# EAGLE schematic 2i (EAGLE 6.4)
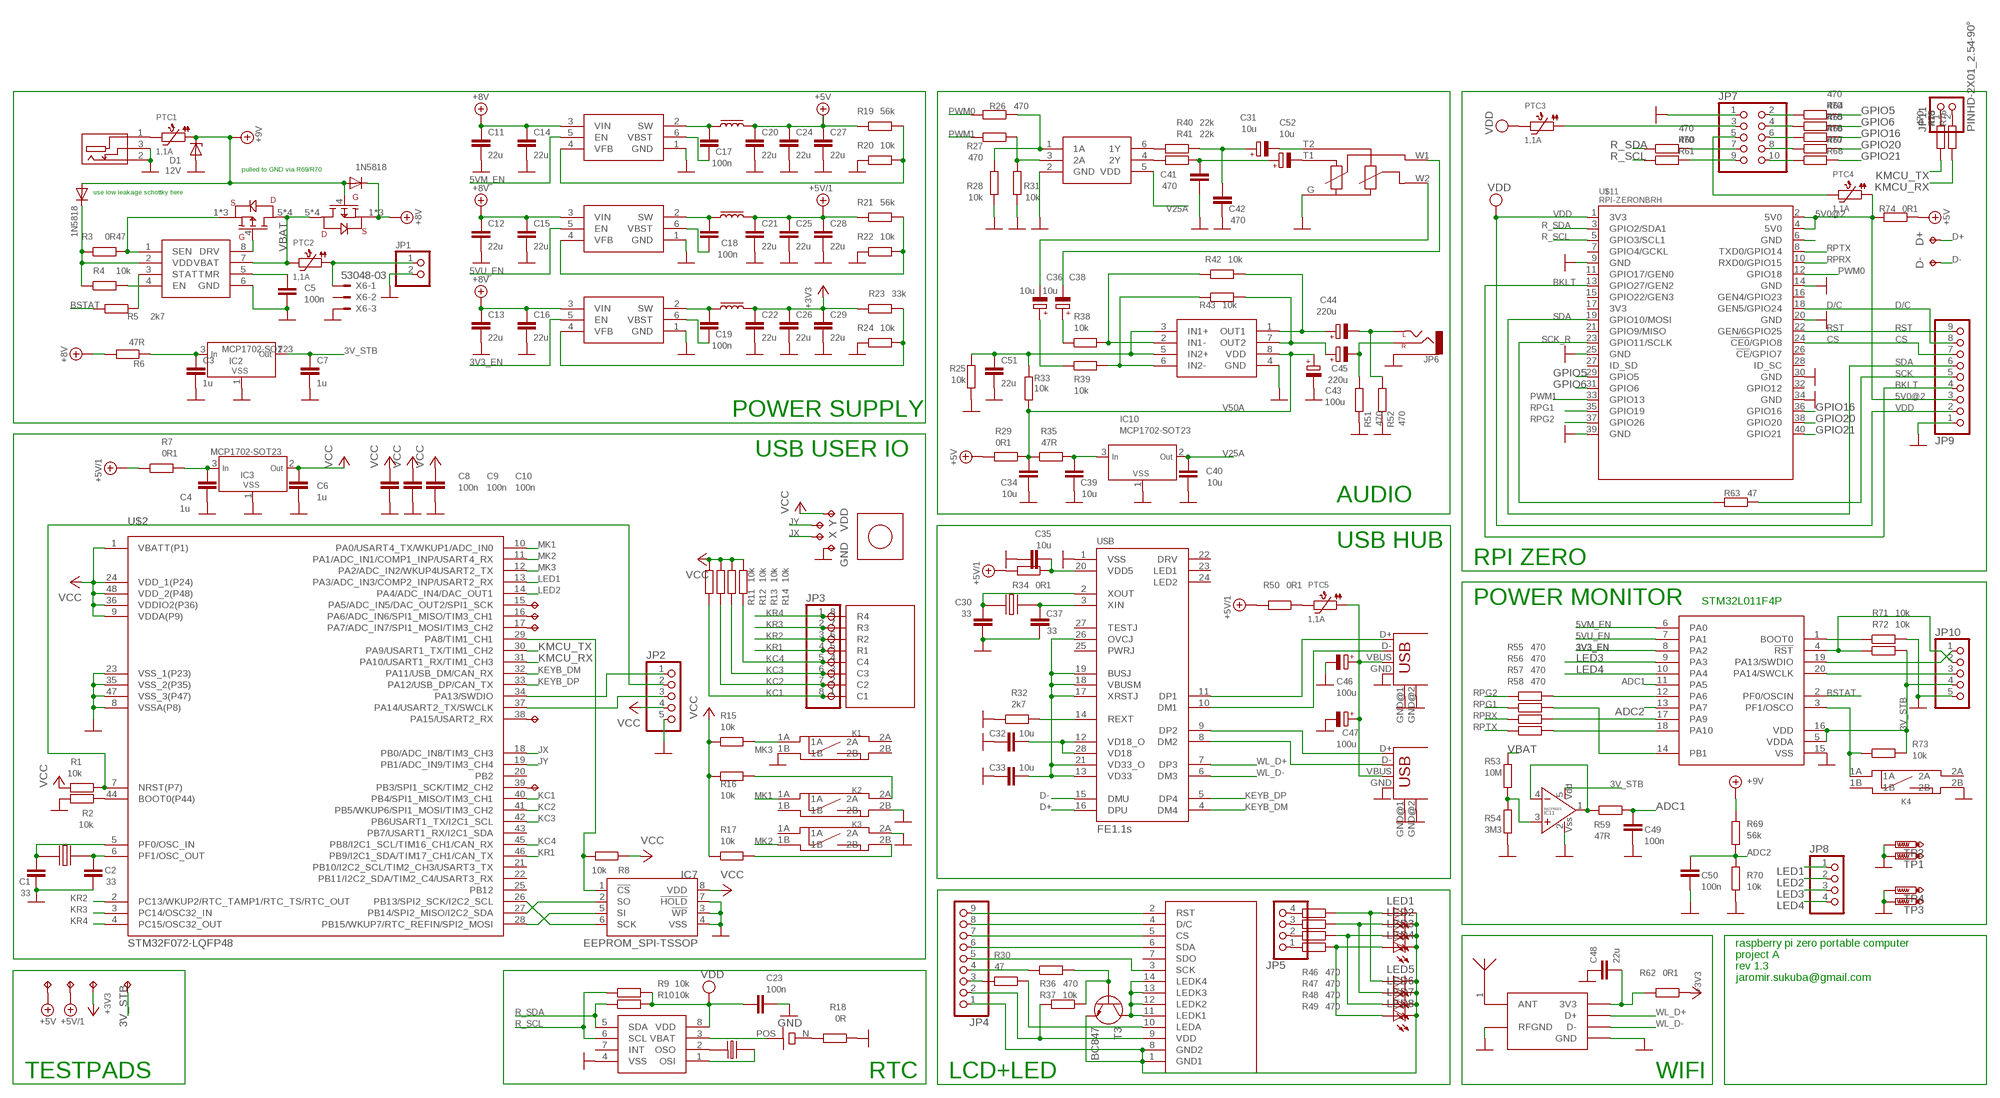
[diagram p0: schematic, sheet 1]

## Parts
ANT1  ANT_RAINSUN_24GHZ  [ANT_RAINSUN-24G]
C1  33  C_0806  [R0805]
C2  33  C_0806  [R0805]
C3  1u  C_0806  [R0805]
C4  1u  C_0806  [R0805]
C5  100n  C_0806  [R0805]
C6  1u  C_0806  [R0805]
C7  1u  C_0806  [R0805]
C8  100n  C_0806  [R0805]
C9  100n  C_0806  [R0805]
C10  100n  C_0806  [R0805]
C11  22u  C_0806  [R0805]
C12  22u  C_0806  [R0805]
C13  22u  C_0806  [R0805]
C14  22u  C_0806  [R0805]
C15  22u  C_0806  [R0805]
C16  22u  C_0806  [R0805]
C17  100n  C_0806  [R0805]
C18  100n  C_0806  [R0805]
C19  100n  C_0806  [R0805]
C20  22u  C_0806  [R0805]
C21  22u  C_0806  [R0805]
C22  22u  C_0806  [R0805]
C23  100n  C_0806  [R0805]
C24  22u  C_0806  [R0805]
C25  22u  C_0806  [R0805]
C26  22u  C_0806  [R0805]
C27  22u  C_0806  [R0805]
C28  22u  C_0806  [R0805]
C29  22u  C_0806  [R0805]
C30  33  C_0806  [R0805]
C31  10u  CPOL-EUA  [PANASONIC_A]
C32  10u  C_0806  [R0805]
C33  10u  C_0806  [R0805]
C34  10u  C_0806  [R0805]
C35  10u  C_0806  [R0805]
C36  10u  CPOL-EUA  [PANASONIC_A]
C37  33  C_0806  [R0805]
C38  10u  CPOL-EUA  [PANASONIC_A]
C39  10u  C_0806  [R0805]
C40  10u  C_0806  [R0805]
C41  470  C_0806  [R0805]
C42  470  C_0806  [R0805]
C43  100u  CPOL-EUD  [PANASONIC_D]
C44  220u  CPOL-EUD  [PANASONIC_D]
C45  220u  CPOL-EUD  [PANASONIC_D]
C46  100u  CPOL-EUD  [PANASONIC_D]
C47  100u  CPOL-EUD  [PANASONIC_D]
C48  22u  C_0806  [R0805]
C49  100n  C_0806  [R0805]
C50  100n  C_0806  [R0805]
C51  22u  C_0806  [R0805]
C52  10u  CPOL-EUA  [PANASONIC_A]
D1  12V  ZENER-DIODESMB  [SMB]
D2  1N5818  DIODE-SMB  [SMB]
D3  1N5818  DIODE-SMB  [SMB]
D+  TPTP14R  [TP14R]
D-  TPTP14R  [TP14R]
GND  TPTP14R  [TP14R]
IC1  MCP73844  [MSOP8]
IC2  MCP1702-SOT23  [SOT23]
IC3  MCP1702-SOT23  [SOT23]
IC4  TPS562200  [SOT23-6]
IC5  TPS562200  [SOT23-6]
IC6  TPS562200  [SOT23-6]
IC7  EEPROM_SPI-TSSOP  [TSSOP8W]
IC8  PCF8523  [SO-08]
IC9  74LVC2G34  [SOT23-6]
IC10  MCP1702-SOT23  [SOT23]
IC11  MCP6021  [SOT23-5L]
JP1  PINHD-1X02_2.54-90°  [1X02/90]
JP2  PINHD-1X05_2.54-90°  [1X05/90]
JP3  PINHD-1X08_2.54  [1X08]
JP4  PINHD-1X09_2.00  [1X09M]
JP5  PINHD-1X04_2.00  [1X04M]
JP6  AUDIO-JACKPTH  [AUDIO-JACK]
JP7  PINHD-2X05_2.54-90°  [2X05/90]
JP8  PINHD-1X04_2.00  [1X04M]
JP9  PINHD-1X09_2.00  [1X09M]
JP10  PINHD-1X05_2.54-90°  [1X05/90]
JP11  PINHD-2X01_2.54-90°  [2X01/90]
K1  SWITCH_BD_B  [SW_SMD2]
K2  SWITCH_BD_B  [SW_SMD2]
K3  SWITCH_BD_B  [SW_SMD2]
K4  SWITCH_BD_B  [SW_SMD2]
LED1  LED3MM  [LED3MM]
LED2  LED3MM  [LED3MM]
LED3  LED3MM  [LED3MM]
LED4  LED3MM  [LED3MM]
LED5  LEDCHIPLED_0805  [CHIPLED_0805]
LED6  LEDCHIPLED_0805  [CHIPLED_0805]
LED7  LEDCHIPLED_0805  [CHIPLED_0805]
LED8  LEDCHIPLED_0805  [CHIPLED_0805]
MOD1  MOD_USB_RTL8188  [MOD_USB_RTL8188]
PTC1  1,1A  PTC1812  [PTC1812]
PTC2  1,1A  PTC1812  [PTC1812]
PTC3  1,1A  PTC1812  [PTC1812]
PTC4  1,1A  PTC1812  [PTC1812]
PTC5  1,1A  PTC1812  [PTC1812]
Q1  CRYSTAL87X38  [CRYST_32K_87X38MM]
R1  10k  R_0805  [R0805]
R2  10k  R_0805  [R0805]
R3  0R47  R_1206  [R1206]
R4  10k  R_0805  [R0805]
R5  2k7  R_0805  [R0805]
R6  47R  R_0805  [R0805]
R7  0R1  R_1206  [R1206]
R8  10k  R_0805  [R0805]
R9  10k  R_0805  [R0805]
R10  10k  R_0805  [R0805]
R11  10k  R_0805  [R0805]
R12  10k  R_0805  [R0805]
R13  10k  R_0805  [R0805]
R14  10k  R_0805  [R0805]
R15  10k  R_0805  [R0805]
R16  10k  R_0805  [R0805]
R17  10k  R_0805  [R0805]
R18  0R  R_0805  [R0805]
R19  56k  R_0805  [R0805]
R20  10k  R_0805  [R0805]
R21  56k  R_0805  [R0805]
R22  10k  R_0805  [R0805]
R23  33k  R_0805  [R0805]
R24  10k  R_0805  [R0805]
R25  10k  R_0805  [R0805]
R26  470  R_0805  [R0805]
R27  470  R_0805  [R0805]
R28  10k  R_0805  [R0805]
R29  0R1  R_1206  [R1206]
R30  47  R_0805  [R0805]
R31  10k  R_0805  [R0805]
R32  2k7  R_0805  [R0805]
R33  10k  R_0805  [R0805]
R34  0R1  R_1206  [R1206]
R35  47R  R_0805  [R0805]
R36  470  R_0805  [R0805]
R37  10k  R_0805  [R0805]
R38  10k  R_0805  [R0805]
R39  10k  R_0805  [R0805]
R40  22k  R_0805  [R0805]
R41  22k  R_0805  [R0805]
R42  10k  R_0805  [R0805]
R43  10k  R_0805  [R0805]
R46  470  R_0805  [R0805]
R47  470  R_0805  [R0805]
R48  470  R_0805  [R0805]
R49  470  R_0805  [R0805]
R50  0R1  R_1206  [R1206]
R51  470  R_0805  [R0805]
R52  470  R_0805  [R0805]
R53  10M  R_0805  [R0805]
R54  3M3  R_0805  [R0805]
R55  470  R_0805  [R0805]
R56  470  R_0805  [R0805]
R57  470  R_0805  [R0805]
R58  470  R_0805  [R0805]
R59  47R  R_0805  [R0805]
R60  470  R_0805  [R0805]
R61  470  R_0805  [R0805]
R62  0R1  R_1206  [R1206]
R63  47  R_0805  [R0805]
R64  470  R_0805  [R0805]
R65  470  R_0805  [R0805]
R66  470  R_0805  [R0805]
R67  470  R_0805  [R0805]
R68  470  R_0805  [R0805]
R69  56k  R_0805  [R0805]
R70  10k  R_0805  [R0805]
R71  10k  R_0805  [R0805]
R72  10k  R_0805  [R0805]
R73  10k  R_0805  [R0805]
R74  0R1  R_1206  [R1206]
R75  470  R_0805  [R0805]
R76  470  R_0805  [R0805]
T1  PFET_SO8  [SO-08]
T2  PFET_SO8  [SO-08]
T3  BC847  [SOT23]
TFT1  DISP_ILI_28  [DISP_ILI_28]
TP1  PTR1PAD1-13  [P1-13]
TP2  PTR1PAD1-13  [P1-13]
TP3  PTR1PAD1-13  [P1-13]
TP4  PTR1PAD1-13  [P1-13]
U$1  CONN_DC_13  [CON_DC13]
U$2  STM32F072-LQFP48  [LQFP48]
U$3  2u2  INDUCTORBOURNS_SRP7030  [BOURNS_SRP7030]
U$4  2u2  INDUCTORBOURNS_SRP7030  [BOURNS_SRP7030]
U$5  2u2  INDUCTORBOURNS_SRP7030  [BOURNS_SRP7030]
U$6  BATTH1220  [BATT_HOLDER_DS1092-12]
U$7  KB1604  [KB1604]
U$8  JOY_PS  [JOY_PS]
U$9  TDA1308  [SO-08]
U$10  POT_DUAL_14X2  [POT_14X2DUAL]
U$11  RPI-ZERONBRH  [RPI_ZERO_NBRH]
U$12  STM32F030_20  [TSSOP20]
USB  FE1.1S  [FE1.1S_SSOP-28]
USB1  USB-A-S  [USB-A-S]
USB2  USB-A-S  [USB-A-S]
VDD  TPTP14R  [TP14R]
X  TPTP14R  [TP14R]
X1  TPTP14R  [TP14R]
X2  CRYST_TC26SMXAS  [CR_12SMXA_S]
X3  TPTP14R  [TP14R]
X4  TPTP14R  [TP14R]
X5  TPTP14R  [TP14R]
X6  53048-03  [53048-03]
X7  TPTP14R  [TP14R]
X8  TPTP14R  [TP14R]
X9  TPTP14R  [TP14R]
X12  TPTP14R  [TP14R]
X13  TPTP14R  [TP14R]
X14  CRYST_TC26SMXAS  [CR_12SMXA_S]
Y  TPTP14R  [TP14R]

## Nets
3V3_EN: IC6.5(EN) U$12.8(PA2)
3V_STB: C7.1 IC2.2(OUT) IC11.5(VDD) JP10.4 R72.2 R73.2 U$12.5(VDDA) U$12.16(VDD) X5.TP
5V0@2: JP9.3 PTC4.P$1 R74.2 U$11.2(5V0) U$11.4(5V0)
5VM_EN: IC4.5(EN) U$12.6(PA0)
5VU_EN: IC5.5(EN) U$12.7(PA1)
+3V3: C22.1 C26.1 C29.1 R23.1 R62.1 U$5.P$2 X4.TP
+5V: C20.1 C24.1 C27.1 R19.1 R29.2 R74.1 U$3.P$2 X1.TP
+5V/1: C21.1 C25.1 C28.1 R7.1 R21.1 R34.2 R50.2 U$4.P$2 X3.TP
+8V: C11.1 C12.1 C13.1 C14.1 C15.1 C16.1 D3.C IC4.3(VIN) IC5.3(VIN) IC6.3(VIN) R6.2 T2.1(S) T2.2(S) T2.3(S)
+9V: D1.C D2.A D3.A PTC1.P$1 R69.2 T2.4(G)
ADC1: C49.2 R59.1 U$12.11(PA5)
ADC2: C50.2 R69.1 R70.2 U$12.13(PA7)
BKLT: JP9.4 U$11.13(GPIO27/GEN2)
BSTAT: R5.2 U$12.2(PF0/OSCIN)
CS: JP9.7 U$11.24(!CE0!/GPIO8)
D+: D+.TP USB.16(DPU)
D-: D-.TP USB.15(DMU)
D/C: JP9.8 U$11.18(GEN5/GPIO24)
GND: C1.1 C2.1 C3.2 C4.2 C5.2 C6.2 C7.2 C8.2 C9.2 C10.2 C11.2 C12.2 C13.2 C14.2 C15.2 C16.2 C20.2 C21.2 C22.2 C23.2 C24.2 C25.2 C26.2 C27.2 C28.2 C29.2 C30.1 C32.1 C33.1 C34.1 C35.1 C37.1 C39.1 C40.1 C41.1 C42.1 C43.- C46.- C47.- C48.1 C49.1 C50.1 C51.2 D1.A GND.TP IC1.6(GND) IC2.1(VSS) IC3.1(VSS) IC4.1(GND) IC5.1(GND) IC6.1(GND) IC7.3(!WP) IC7.4(VSS) IC7.7(!HOLD) IC8.4(VSS) IC9.2(GND) IC10.1(VSS) IC11.2(VSS) JP1.2 JP2.5 JP6.SLEEVE JP7.1 JP9.1 JP10.5 K1.1B K2.2B K3.2A K4.2B MOD1.GND MOD1.RFGND R2.2 R18.1 R20.1 R22.1 R24.1 R25.1 R28.1 R31.1 R32.1 R51.2 R52.2 R54.1 R70.1 R71.2 TP1.TP TP2.TP TP3.TP TP4.TP U$1.2(N) U$1.3(SW) U$2.8(VSSA(P8)) U$2.23(VSS_1(P23)) U$2.35(VSS_2(P35)) U$2.47(VSS_3(P47)) U$9.4(GND) U$10.G U$11.9(GND) U$11.14(GND) U$11.20(GND) U$11.25(GND) U$11.30(GND) U$11.34(GND) U$11.39(GND) U$12.15(VSS) USB1.GND USB1.GND@1(GND) USB1.GND@2(GND) USB2.GND USB2.GND@1(GND) USB2.GND@2(GND) USB.1(VSS) X6.3
GND@8: U$11.6(GND)
GPIO5: R64.2 U$11.29(GPIO5)
GPIO6: R65.2 U$11.31(GPIO6)
GPIO16: R66.2 U$11.36(GPIO16)
GPIO20: R67.2 U$11.38(GPIO20)
GPIO21: R68.2 U$11.40(GPIO21)
JX: U$2.18(PB0/ADC_IN8/TIM3_CH3) X.TP
JY: U$2.19(PB1/ADC_IN9/TIM3_CH4) Y.TP
KC1: JP3.8 R11.1 U$2.40(PB4/SPI1_MISO/TIM3_CH1) U$7.1(C1)
KC2: JP3.7 R12.1 U$2.41(PB5/WKUP6/SPI1_MOSI/TIM3_CH2) U$7.2(C2)
KC3: JP3.6 R13.1 U$2.42(PB6USART1_TX/I2C1_SCL) U$7.3(C3)
KC4: JP3.5 R14.1 U$2.45(PB8/I2C1_SCL/TIM16_CH1/CAN_RX) U$7.4(C4)
KEYB_DM: U$2.32(PA11/USB_DM/CAN_RX) USB.4(DM4)
KEYB_DP: U$2.33(PA12/USB_DP/CAN_TX) USB.5(DP4)
KMCU_RX: R76.1 U$2.31(PA10/USART1_RX/TIM1_CH3)
KMCU_TX: R75.1 U$2.30(PA9/USART1_TX/TIM1_CH2)
KR1: JP3.4 U$2.46(PB9/I2C1_SDA/TIM17_CH1/CAN_TX) U$7.5(R1)
KR2: JP3.3 U$2.2(PC13/WKUP2/RTC_TAMP1/RTC_TS/RTC_OUT) U$7.6(R2)
KR3: JP3.2 U$2.3(PC14/OSC32_IN) U$7.7(R3)
KR4: JP3.1 U$2.4(PC15/OSC32_OUT) U$7.8(R4)
LED1: JP8.1 U$2.13(PA3/ADC_IN3/COMP2_INP/USART2_RX)
LED2: JP8.2 U$2.14(PA4/ADC_IN4/DAC_OUT1)
LED3: JP8.3 U$12.9(PA3)
LED4: JP8.4 U$12.10(PA4)
MK1: K2.1A U$2.10(PA0/USART4_TX/WKUP1/ADC_IN0)
MK2: K3.1B U$2.11(PA1/ADC_IN1/COMP1_INP/USART4_RX)
MK3: K1.1A R15.2 U$2.12(PA2/ADC_IN2/WKUP4USART2_TX)
N$2: C35.2 R34.1 USB.20(VDD5)
N$3: C17.2 IC4.2(SW) U$3.P$1
N$5: JP4.3 R30.2
N$6: IC7.6(SCK) U$2.26(PB13/SPI2_SCK/I2C2_SCL)
N$7: R36.2 R37.1 T3.1(B)
N$8: JP4.4 R36.1
N$9: IC1.1(SEN) R3.2 T1.1(S) T1.2(S) T1.3(S)
N$10: USB2.D+ USB.9(DP2)
N$11: USB2.D- USB.8(DM2)
N$12: USB1.D- USB.10(DM1)
N$13: IC1.8(DRV) T1.4(G)
N$14: IC1.4(EN) R4.2
N$15: USB1.D+ USB.11(DP1)
N$16: C33.2 USB.13(VD33) USB.17(XRSTJ) USB.18(VBUSM) USB.19(BUSJ) USB.21(VD33_O) USB.26(OVCJ)
N$17: IC11.1(.:VYSTUP) IC11.4(.:IN-) R59.2
N$18: C32.2 USB.12(VD18_O) USB.28(VD18)
N$19: C5.1 IC1.5(TMR)
N$20: C17.1 IC4.6(VBST)
N$21: R32.2 USB.14(REXT)
N$22: IC4.4(VFB) R19.2 R20.2
N$23: C30.2 USB.2(XOUT) X14.P$1
N$24: C18.2 IC5.2(SW) U$4.P$1
N$25: C18.1 IC5.6(VBST)
N$26: C37.2 USB.3(XIN) X14.P$2
N$27: C46.+ C47.+ PTC5.P$1 USB1.VBUS USB2.VBUS
N$28: IC7.2(SO) U$2.27(PB14/SPI2_MISO/I2C2_SDA)
N$30: IC9.6(1Y) R40.2
N$31: IC9.4(2Y) R41.2
N$32: C31.+ C42.2 R40.1
N$33: C41.2 C52.+ R41.1
N$34: C44.- JP6.TIP(LEFT) R52.1
N$35: C45.- JP6.RING(RIGHT) R51.1
N$36: C44.+ R42.2 U$9.1(OUT1)
N$37: C45.+ R43.2 U$9.7(OUT2)
N$38: C51.1 R25.2 R33.1 U$9.3(IN1+) U$9.5(IN2+)
N$39: R38.2 R42.1 U$9.2(IN1-)
N$40: R39.2 R43.1 U$9.6(IN2-)
N$41: C38.+ R38.1
N$42: C36.+ R39.1
N$43: C36.- U$10.W2
N$44: C38.- U$10.W1
N$46: ANT1.1 MOD1.ANT
N$47: JP11.1 R75.2
N$48: IC5.4(VFB) R21.2 R22.2
N$49: C19.2 IC6.2(SW) U$5.P$1
N$50: C19.1 IC6.6(VBST)
N$51: JP2.1 U$2.34(PA13/SWDIO)
N$53: IC6.4(VFB) R23.2 R24.2
N$54: C4.1 IC3.3(IN) R7.2
N$55: JP2.3 U$2.37(PA14/USART2_TX/SWCLK)
N$57: D2.C IC1.2(VDD) R3.1 R4.1
N$58: PTC1.P$2 U$1.1(P)
N$59: IC9.1(1A) R26.1 R28.2
N$60: IC9.3(2A) R27.1 R31.2
N$62: C1.2 U$2.5(PF0/OSC_IN) X2.P$1
N$64: JP11.2 R76.2
N$65: IC7.5(SI) U$2.28(PB15/WKUP7/RTC_REFIN/SPI2_MOSI)
N$66: IC7.1(!CS) R8.2 U$2.29(PA8/TIM1_CH1)
N$67: R56.2 U$12.14(PB1)
N$68: U$2.15(PA5/ADC_IN5/DAC_OUT2/SPI1_SCK) X7.TP
N$69: R2.1 U$2.44(BOOT0(P44))
N$70: JP5.4 R46.2
N$71: JP5.3 R47.2
N$72: JP5.2 R48.2
N$73: JP5.1 R49.2
N$74: JP2.2 R1.1 U$2.7(NRST(P7))
N$75: R57.2 U$12.17(PA9)
N$76: R58.2 U$12.18(PA10)
N$77: PTC5.P$2 R50.1
N$78: R55.2 U$12.12(PA6)
N$79: U$2.16(PA6/ADC_IN6/SPI1_MISO/TIM3_CH1) X8.TP
N$80: U$2.17(PA7/ADC_IN7/SPI1_MOSI/TIM3_CH2) X9.TP
N$81: U$2.38(PA15/USART2_RX) X12.TP
N$82: U$2.39(PB3/SPI1_SCK/TIM2_CH2) X13.TP
N$83: JP10.1 U$12.19(PA13/SWDIO)
N$84: JP10.3 U$12.20(PA14/SWCLK)
N$85: JP10.2 R72.1 U$12.4(!RST)
N$86: JP1.1 PTC2.P$1 X6.1
N$87: C52.- U$10.T1
N$89: K4.1A R73.1 U$12.3(PF1/OSCO)
N$90: C2.2 U$2.6(PF1/OSC_OUT) X2.P$2
N$92: IC8.3(VBAT) U$6.POS(P)
N$94: R18.2 U$6.N(M)
N$95: LED1.A LED5.A R46.1
N$96: LED2.A LED6.A R47.1
N$97: K3.2B R17.2
N$98: IC8.2(OSO) Q1.4
N$99: IC8.1(OSI) Q1.1
N$100: K2.2A R16.2
N$101: LED3.A LED7.A R48.1
N$102: LED4.A LED8.A R49.1
N$103: JP4.5 TFT1.3(SCK)
N$104: JP4.1 LED1.K(C) LED2.K(C) LED3.K(C) LED4.K(C) LED5.C LED6.C LED7.C LED8.C T3.2(E) TFT1.1(GND1) TFT1.8(GND2)
N$106: T3.3(C) TFT1.11(LEDK1) TFT1.12(LEDK2) TFT1.13(LEDK3) TFT1.14(LEDK4)
N$107: JP7.5 PTC4.P$2
N$108: IC1.3(STAT) R5.1
N$109: JP7.3 PTC3.P$1
N$110: C48.2 MOD1.3V3 R62.2
N$111: IC11.3(.:NEIN+) R53.1 R54.2
N$112: C3.1 IC2.3(IN) R6.1
N$113: R71.1 U$12.1(BOOT0)
N$114: C31.- U$10.T2
N$115: R30.1 TFT1.10(LEDA)
N$116: JP4.2 R37.2 TFT1.9(VDD)
N$117: C39.2 IC10.3(IN) R35.2
N$118: JP4.6 TFT1.6(SDA)
N$119: JP4.7 TFT1.5(CS)
N$120: JP4.8 TFT1.4(D/C)
N$121: JP4.9 TFT1.2(RST)
N$125: JP7.10 R68.1
N$126: JP7.8 R67.1
N$127: JP7.6 R66.1
N$128: JP7.4 R65.1
N$129: JP7.2 R64.1
N$130: JP7.7 R60.2
N$131: JP7.9 R61.2
PWM0: R27.2 U$11.12(GPIO18)
PWM1: R26.2 U$11.33(GPIO13)
R_SCL: IC8.6(SCL) R9.1 R61.1 U$11.5(GPIO3/SCL1)
R_SDA: IC8.5(SDA) R10.1 R60.1 U$11.3(GPIO2/SDA1)
RPG1: R56.1 U$11.35(GPIO19)
RPG2: R55.1 U$11.37(GPIO26)
RPRX: R57.1 U$11.10(RXD0/GPIO15)
RPTX: R58.1 U$11.8(TXD0/GPIO14)
RST: JP9.9 U$11.22(GEN/6GPIO25)
SCK: JP9.5 R63.1
SCK_R: R63.2 U$11.23(GPIO11/SCLK)
SDA: JP9.6 U$11.19(GPIO10/MOSI)
V25A: C40.2 IC9.5(VDD) IC10.2(OUT)
V50A: C34.2 C43.+ R29.1 R33.2 R35.1 U$9.8(VDD)
VBAT: IC1.7(VBAT) PTC2.P$2 R53.2 T1.5(D) T1.6(D) T1.7(D) T1.8(D) T2.5(D) T2.6(D) T2.7(D) T2.8(D)
VCC: C6.1 C8.1 C9.1 C10.1 IC3.2(OUT) IC7.8(VDD) JP2.4 R1.2 R8.1 R11.2 R12.2 R13.2 R14.2 R15.1 R16.1 R17.1 U$2.1(VBATT(P1)) U$2.9(VDDA(P9)) U$2.24(VDD_1(P24)) U$2.36(VDDIO2(P36)) U$2.48(VDD_2(P48)) VDD.TP
VDD: C23.1 IC8.8(VDD) JP9.2 PTC3.P$2 R9.2 R10.2 U$11.1(3V3)
WL_D+: MOD1.D+ USB.7(DP3)
WL_D-: MOD1.D- USB.6(DM3)
Unconnected: IC8.7(INT) K1.2A K1.2B K2.1B K3.1A K4.1B K4.2A TFT1.7(SDO) U$2.20(PB2) U$2.21(PB10/I2C2_SCL/TIM2_CH3/USART3_TX) U$2.22(PB11/I2C2_SDA/TIM2_C4/USART3_RX) U$2.25(PB12) U$2.43(PB7/USART1_RX/I2C1_SDA) U$11.7(GPIO4/GCKL) U$11.11(GPIO17/GEN0) U$11.15(GPIO22/GEN3) U$11.16(GEN4/GPIO23) U$11.17(3V3) U$11.21(GPIO9/MISO) U$11.26(!CE!/GPIO7) U$11.27(ID_SD) U$11.28(ID_SC) U$11.32(GPIO12) USB.22(DRV) USB.23(LED1) USB.24(LED2) USB.25(PWRJ) USB.27(TESTJ) X6.2

## Notes on the sheet
- pulled to GND via R69/R70
- use low leakage schottky here
- POWER SUPPLY
- USB USER IO
- AUDIO
- USB HUB
- RPI ZERO
- POWER MONITOR | STM32L011F4P
- raspberry pi zero portable computer
- project A
- rev 1.3
- jaromir.sukuba@gmail.com
- TESTPADS | RTC | LCD+LED | WIFI

## Library data of the parts
ANT1 = _moja:ANT_RAINSUN_24GHZ
C1-C30 C32-C35 C37 C39-C42 C48-C51 = _moja:C
C31 C36 C38 C43-C47 C52 = _rcl:CPOL-EU: POLARIZED CAPACITOR, European symbol
D1 = diode:ZENER-DIODE: Z-Diode
D2 D3 = diode:DIODE-: DIODE
D+ D- GND VDD X X1 X3-X5 X7-X9 X12 X13 Y = testpad:TP: Test pad
IC1 = _mcom6:MCP73844
IC2 IC3 IC10 = _mcom6:MCP1702
IC4-IC6 = _mcom6:TPS562200
IC7 = _mcom6:EEPROM_SPI
IC8 = _mcom6:PCF8523
IC9 = _mcom6:74LVC2G34
IC11 = _mcom6:MCP6021
JP1 = pinhead-2:PINHD-1X02: PIN HEADER
JP2 JP10 = pinhead-2:PINHD-1X05: PIN HEADER
JP3 = pinhead-2:PINHD-1X08: PIN HEADER
JP4 JP9 = pinhead-2:PINHD-1X09: PIN HEADER
JP5 JP8 = pinhead-2:PINHD-1X04: PIN HEADER
JP6 = SparkFun-Connectors:AUDIO-JACK: 3.5mm Audio Jack Simple 3.5mm common PCB mount audio jack. SKU: PRT-08032
JP7 = pinhead-2:PINHD-2X05: PIN HEADER
JP11 = pinhead-2:PINHD-2X01
K1-K4 = _moja:SWITCH_BD
LED1-LED8 = led:LED: LED OSRAM: - CHIPLED LG R971, LG N971, LY N971, LG Q971, LY Q971, LO R971, LY R971 LH N974, LH R974 LS Q976, LO Q976, LY Q976 LO Q996 - Hyper CHIPLED LW Q18S LB Q993, LB Q99A, LB R99A - SideLED LS A670, LO A670, LY A670, LG A670, LP A670 LB A673, LV A673, LT A673, LW A673 LH A674 LY A675 LS A676, LA A676, LO A676, LY A676, LW A676 LS A679, LY A679, LG A679 - Hyper Micro SIDELED® LS Y876, LA Y876, LO Y876, LY Y876 LT Y87S - SmartLED LW L88C, LW L88S LB L89C, LB L89S, LG L890 LS L89K, LO L89K, LY L89K LS L896, LA L896, LO L896, LY L896 - TOPLED LS T670, LO T670, LY T670, LG T670, LP T670 LSG T670, LSP T670, LSY T670, LOP T670, LYG T670 LG T671, LOG T671, LSG T671 LB T673, LV T673, LT T673, LW T673 LH T674 LS T676, LA T676, LO T676, LY T676, LB T676, LH T676, LSB T676, LW T676 LB T67C, LV T67C, LT T67C, LS T67K, LO T67K, LY T67K, LW E67C LS E67B, LA E67B, LO E67B, LY E67B, LB E67C, LV E67C, LT E67C LW T67C LS T679, LY T679, LG T679 LS T770, LO T770, LY T770, LG T770, LP T770 LB T773, LV T773, LT T773, LW T773 LH T774 LS E675, LA E675, LY E675, LS T675 LS T776, LA T776, LO T776, LY T776, LB T776 LHGB T686 LT T68C, LB T68C - Hyper Mini TOPLED® LB M676 - Mini TOPLED Santana® LG M470 LS M47K, LO M47K, LY M47K Source: http://www.osram.convergy.de LUXEON: - LUMILED® LXK2-PW12-R00, LXK2-PW12-S00, LXK2-PW14-U00, LXK2-PW14-V00 LXK2-PM12-R00, LXK2-PM12-S00, LXK2-PM14-U00 LXK2-PE12-Q00, LXK2-PE12-R00, LXK2-PE12-S00, LXK2-PE14-T00, LXK2-PE14-U00 LXK2-PB12-K00, LXK2-PB12-L00, LXK2-PB12-M00, LXK2-PB14-N00, LXK2-PB14-P00, LXK2-PB14-Q00 LXK2-PR12-L00, LXK2-PR12-M00, LXK2-PR14-Q00, LXK2-PR14-R00 LXK2-PD12-Q00, LXK2-PD12-R00, LXK2-PD12-S00 LXK2-PH12-R00, LXK2-PH12-S00 LXK2-PL12-P00, LXK2-PL12-Q00, LXK2-PL12-R00 Source: www.luxeon.com KINGBRIGHT: KA-3528ASYC Source: www.kingbright.com
MOD1 = _moja:MOD_USB_RTL8188
PTC1-PTC5 = _microbuilder:PTC: PTC (Resettable Fuse) 1206 Package 250mA PTC (16V Max, Time-to-Trip: 0.08s) - Digikey: F2110CT-ND 1210 Package 100mA PTC (30V Max, Time-to-Trip: 0.6s) - Digikey: MF-USMF010-2CT-ND 1812 Package 750mA PTC (24V Max, Time-to-Trip: 0.2s) - Digikey: MF-MSMF075/24-2CT-ND
Q1 = _mcom6:CRYSTAL
R1-R43 R46-R76 = _moja:R
T1 T2 = _mcom6:PFET_SO8
T3 = _mcom6:BC847
TFT1 = _moja:DISP_ILI_28
TP1-TP4 = testpad:PTR1: TEST PIN
U$1 = _moja:CONN_DC_13
U$2 = stm32f0:STM32F072
U$3-U$5 = _mcs1:INDUCTOR
U$6 = _moja:BATT
U$7 = _moja:KB1604
U$8 = _moja:JOY_PS
U$9 = _mcom6:TDA1308
U$10 = _moja:POT_DUAL_14X2
U$11 = RPI-Zero:RPI-ZERO
U$12 = _jl4:STM32F030_20: valid for STM32f030, STM32F031 in TSSOP20
USB = imcom:FE1.1S: A USB 2.0 hub IC. http://www.jfd-ic.com/Documents/FE1.1s%20Data%20Sheet%20%28Rev.%201.0%29.pdf
USB1 USB2 = con-usb-2:USB: USB Connectors
X2 X14 = _moja:CRYST_TC26
X6 = con-molex:53?-03: CONNECTOR wire to board 1.25 mm (.049 inch) pitch header; MF: WALDOM/MOLEX; MPN: 53048-0310; OC_FARNELL: 9732918; OC_NEWARK: 38C9908